# Altium schematic sheet Amp Bias.SchDoc
size 406 x 304 mm; SheetNumber: 4; SheetTotal: 6
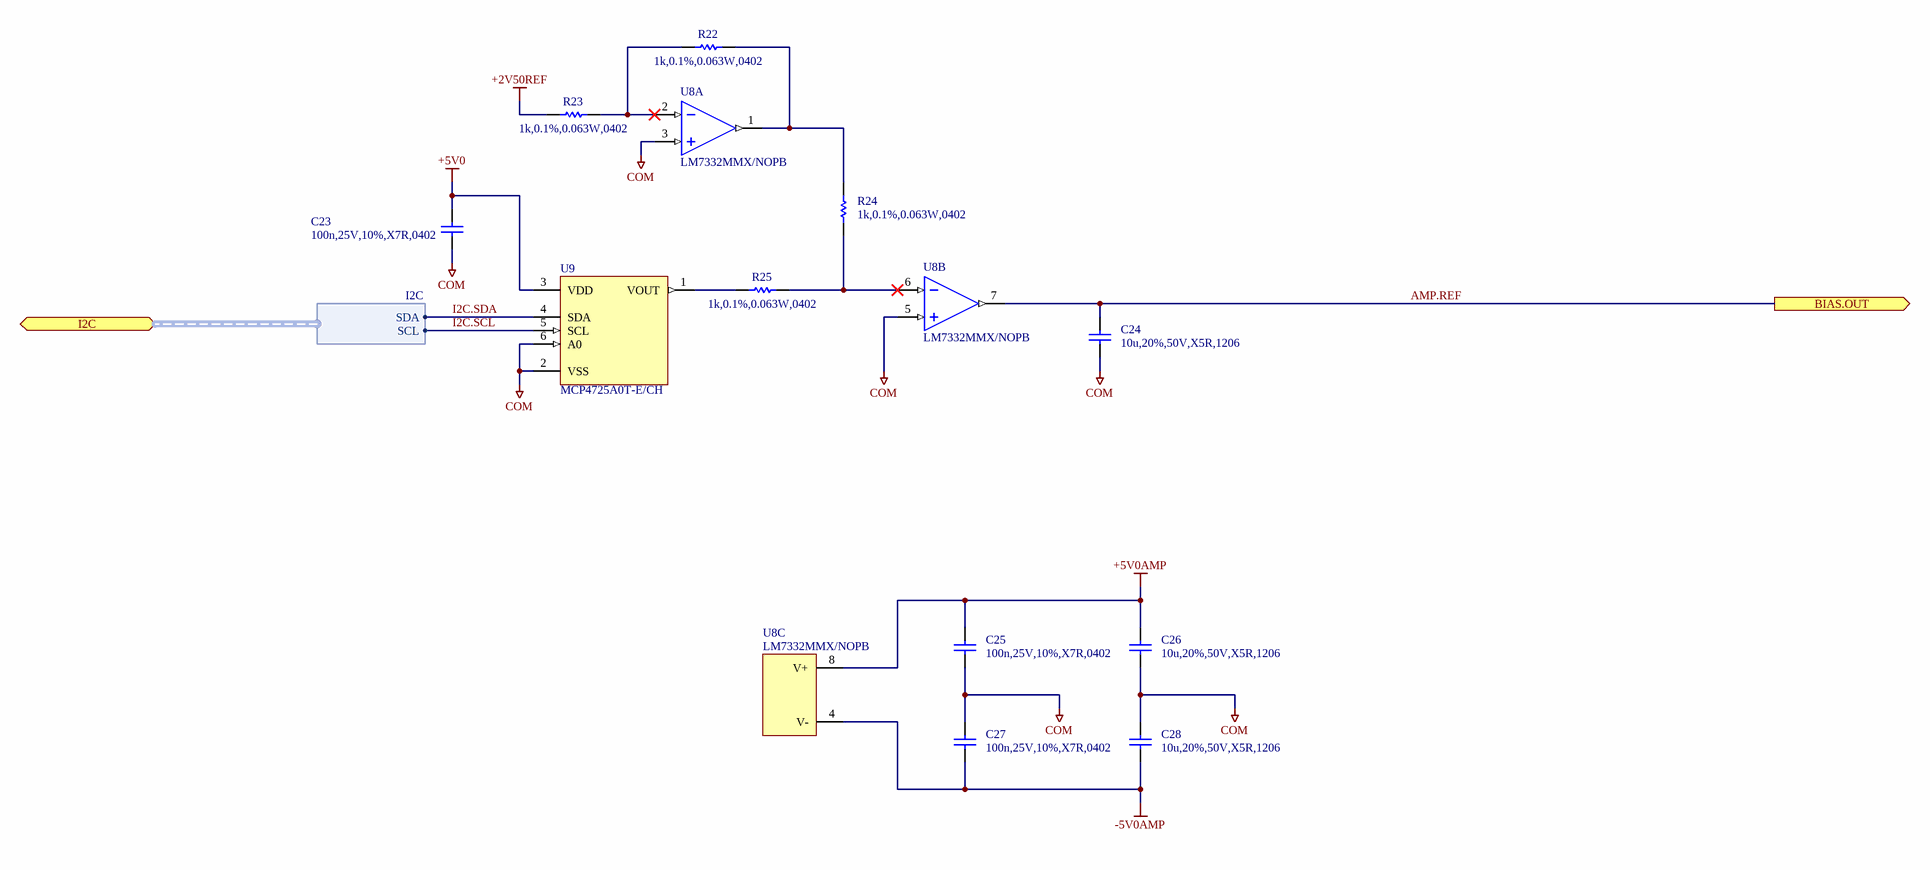
[diagram p0: Amp Bias.SchDoc]

## Parts
C23  100n,25V,10%,X7R,0402  [CAPC1005X06N]
C24  10u,20%,50V,X5R,1206  [CAPC3216X16N]
C25  100n,25V,10%,X7R,0402  [CAPC1005X06N]
C26  10u,20%,50V,X5R,1206  [CAPC3216X16N]
C27  100n,25V,10%,X7R,0402  [CAPC1005X06N]
C28  10u,20%,50V,X5R,1206  [CAPC3216X16N]
R22  1k,0.1%,0.063W,0402  [RESC1005X04N]
R23  1k,0.1%,0.063W,0402  [RESC1005X04N]
R24  1k,0.1%,0.063W,0402  [RESC1005X04N]
R25  1k,0.1%,0.063W,0402  [RESC1005X04N]
U8  LM7332MMX/NOPB  [TEXASINSTRUMENTS_PKG_DGK0008A]  (parts A,B,C of 3)
U9  MCP4725A0T-E/CH  [SOTFL95P260X145-6]

## Ports
BIAS.OUT (out), I2C (bidir, harness I2C)

## Harnesses
I2C: SCL, SDA

## Nets
+2V50REF: R23.1
+5V0: C23.2 U9.3(VDD)
+5V0AMP: C25.2 C26.2 U8.8(V+)
-5V0AMP: C27.1 C28.1 U8.4(V-)
COM: C23.1 C24.1 C25.1 C26.1 C27.2 C28.2 U8.3(INA+) U8.5(INB+) U9.2(VSS) U9.6(A0)
AMP.REF: C24.2 U8.7(OUTB) ; port BIAS.OUT
I2C.SCL: U9.5(SCL) ; port I2C.SCL
I2C.SDA: U9.4(SDA) ; port I2C.SDA
NetR22_1: R22.1 R23.2 U8.2(INA-)
NetR22_2: R22.2 R24.1 U8.1(OUTA)
NetR24_2: R24.2 R25.2 U8.6(INB-)
NetR25_1: R25.1 U9.1(VOUT)

## Notes on the sheet
- Sheet Name:
- Date:
- Sheet
- Designer:
- of

## Library data of the parts
C23 C25 C27 = CAP,Cer,100nF,10%,25VDC,X7R,0402: 0.1ï¿½F ï¿½10% 25V Ceramic Capacitor X7R 0402 (1005 Metric); Manufacturer 1: Murata Electronics; Manufacturer 1 Part Number: GRM155R71E104KE14J; Vendor 1 Part Number: 490-14603-1-ND; Vendor 1: DigiKey; Value: 100nF; Part Name: CAP,Cer,100nF,10%,25VDC,X7R,0402; CreatedBy: Judd Foster; HelpURL: https://search.murata.co.jp/Ceramy/image/img/A01X/G101/ENG/GRM155R71E104KE14-01.pdf
C24 C26 C28 = CAP,Cer,10uF,50VDC,X5R,1206: 10ï¿½F ï¿½20% 50V Ceramic Capacitor X5R 1206 (3216 Metric); Manufacturer 1: Samsung Electro-Mechanics; Manufacturer 1 Part Number: CL31A106MBHNNNE; Vendor 1 Part Number: 1276-6736-1-ND; Vendor 1: Digikey; Part Name: CAP,Cer,10uF,50VDC,X5R,1206; CreatedBy: Judd Foster; HelpURL: https://www.samsungsem.com/resources/file/global/support/product_catalog/MLCC.pdf; Value: 10u
R22-R25 = RES,1k,0.1%,0.063W,0402: 1 kOhms Â±0.1% 0.063W, 1/16W Chip Resistor 0402 (1005 Metric) Thin Film; Manufacturer 1: YAGEO; Manufacturer 1 Part Number: RT0402BRE071KL; Vendor 1 Part Number: YAG2306CT-ND; Vendor 1: DigiKey; Part Name: RES,1k,0.1%,0.063W,0402; CreatedBy: Judd Foster; HelpURL: https://www.yageo.com/upload/media/product/app/datasheet/rchip/pyu-rt_1-to-0.01_rohs_l.pdf; Value: 1k
U8 = LM7332MMX_NOPB: General Purpose Amplifier 2 Circuit Rail-to-Rail 8-VSSOP; Manufacturer 1: Texas Instruments; Vendor 1 Part Number: 296-LM7332MMX/NOPBCT-ND; Vendor 1: DigiKey; Part Name: LM7332MMX_NOPB; CreatedBy: Judd Foster; HelpURL: https://www.ti.com/lit/ds/symlink/lm7332.pdf?HQS=dis-dk-null-digikeymode-dsf-pf-null-wwe&ts=1730932081789&ref_url=https%253A%252F%252Fwww.ti.com%252Fgeneral%252Fdocs%252Fsuppproductinfo.tsp%253FdistId%253D10%2526gotoUrl%253Dhttps%253A%252F%252Fwww.ti.com%; Manufacturer 1 Part Number: LM7332MMX/NOPB
U9 = MCP4725A0T-E/CH: 6us 12 I2C 2.7V~5.5V SOT-23-6 Digital To Analog Converters (DACs) ROHS; Manufacturer 1: Microchip; Vendor 1 Part Number: C144198; Vendor 1: LCSC; Part Name: MCP4725A0T-E/CH; CreatedBy: Judd Foster; HelpURL: https://datasheet.lcsc.com/lcsc/1811151442_Microchip-Tech-MCP4725A0T-E-CH_C144198.pdf; Manufacturer 1 Part Number: MCP4725A0T-E/CH